# EasyEDA schematic 6coils-1-discrete.json
TITLE: Sheet_1; REV: 1.0; Date: 2023-10-23; Sheet: 1/1; Company: Your Company
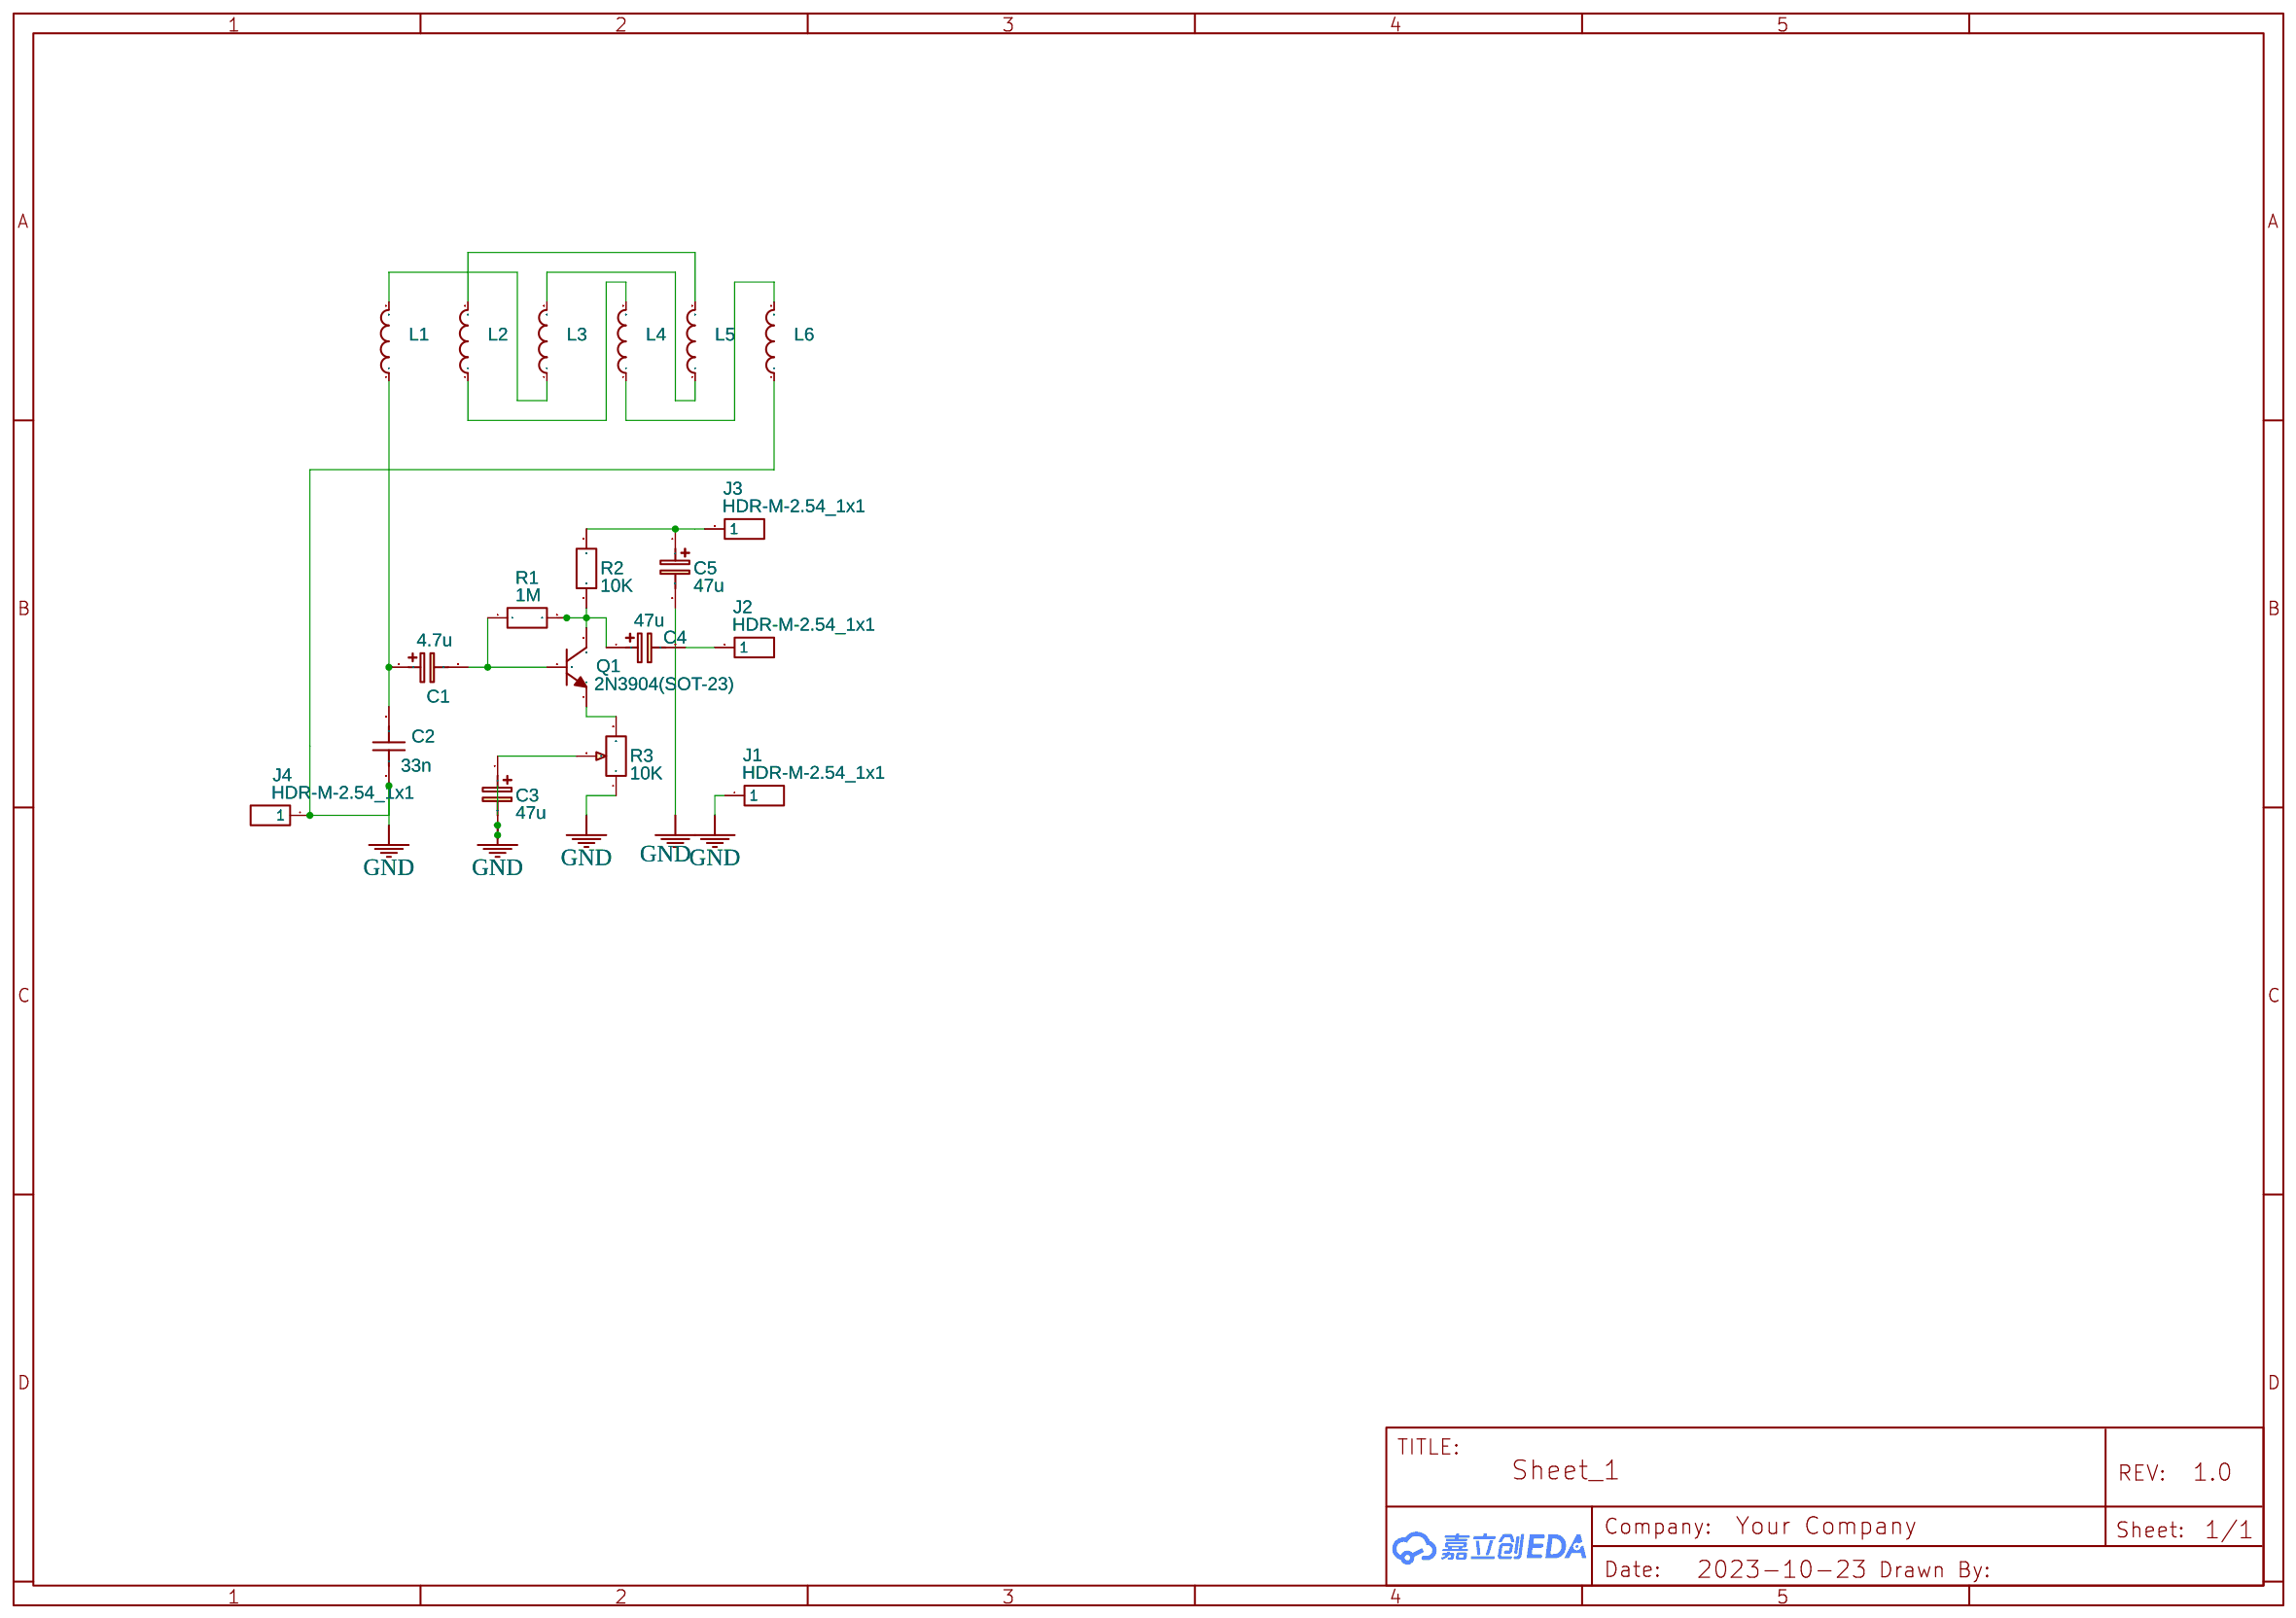
[diagram p0: schematic sheet]

## Parts
C1  4.7u  [CPOL-RADIAL-10UF-25V-KIT]
C2  33n  [CPOL-RADIAL-10UF-25V-KIT]
C3  47u  [CPOL-RADIAL-100UF-25V]
C4  47u  [CPOL-RADIAL-100UF-25V]
C5  47u  [CPOL-RADIAL-100UF-25V]
J1  HDR-M-2.54_1x1  [HDR-M-2.54_1X1]
J2  HDR-M-2.54_1x1  [HDR-M-2.54_1X1]
J3  HDR-M-2.54_1x1  [HDR-M-2.54_1X1]
J4  HDR-M-2.54_1x1  [HDR-M-2.54_1X1]
L1  INDUCTOR_SMD:L_COILCRAFT_XXL4040  [IND-SMD_L4.0-W4.0]
L2  INDUCTOR_SMD:L_COILCRAFT_XXL4040  [IND-SMD_L4.0-W4.0]
L3  INDUCTOR_SMD:L_COILCRAFT_XXL4040  [IND-SMD_L4.0-W4.0]
L4  INDUCTOR_SMD:L_COILCRAFT_XXL4040  [IND-SMD_L4.0-W4.0]
L5  INDUCTOR_SMD:L_COILCRAFT_XXL4040  [IND-SMD_L4.0-W4.0]
L6  INDUCTOR_SMD:L_COILCRAFT_XXL4040  [IND-SMD_L4.0-W4.0]
Q1  2N3904(SOT-23)  [SOT-23-3_L2.9-W1.3-P1.90-LS2.4-TR]
R1  1M  [axial]
R2  10K  [axial]
R3  10K  [RES-ADJ-TH_RM063-103]

## Library data of the parts
C1 C3-C5 = C_Tan_SMD_A_EU: Contributor: LCEDA_Lib
C2 = C_0603_US: Contributor: LCEDA_Lib
J1-J4 = HDR-M-2.54_1x1: Supplier Part: C81276; Supplier: LCSC; Contributor: LCEDA_Lib
L1-L6 = INDUCTOR_SMD:L_COILCRAFT_XXL4040: Contributor: LCSC; Supplier: LCSC; Supplier Part: C9900003196; Manufacturer: null; JLCPCB Part Class: Extended Part
Q1 = 2N3904(SOT-23): Supplier: LCSC; Manufacturer: KEC; Manufacturer Part: 2n3904S-RTK/PS; Supplier Part: C18536; Paste Type: SOT-23; Contributor: LCEDA_Lib
R1 R2 = R_0603_EU: Contributor: LCEDA_Lib
R3 = RM063-103 10K: Supplier: LCSC; Manufacturer: JML; Supplier Part: C38793

## Nets
GND: C2.1 C3.2 C5.2 J1.1 J4.1 L6.1 R3.1
Net-(C1-1): C1.1 C2.2 L1.1
Net-(C1-2): C1.2 Q1.2(B) R1.1
Net-(C3-1): C3.1 R3.2
Net-(C4-1): C4.1 Q1.3(C) R1.2 R2.1
Net-(C4-2): C4.2 J2.1
Net-(C5-1): C5.1 J3.1 R2.2
Net-(L1-2): L1.2 L3.1
Net-(L2-1): L2.1 L4.2
Net-(L2-2): L2.2 L5.2
Net-(L3-2): L3.2 L5.1
Net-(L4-1): L4.1 L6.2
Net-(Q1-1): Q1.1(E) R3.3
